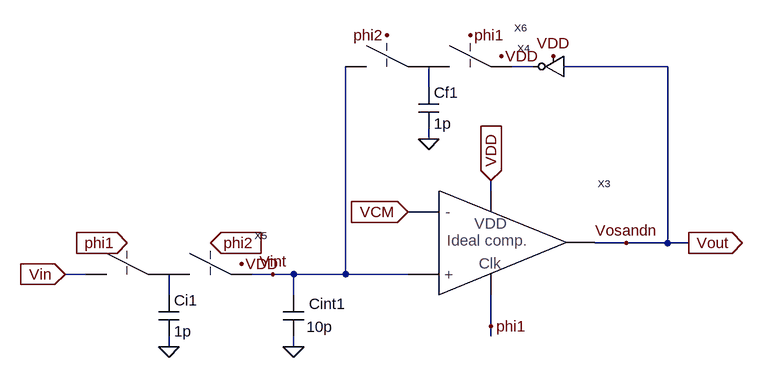
[diagram p0: schematic 1_bit_1st_PNS_SCmod_MSD.asc]
1_bit_1st_PNS_SCmod_MSD.asc, the LTspice schematic file:
Version 4
SHEET 1 1428 680
WIRE 1072 -320 1040 -320
WIRE 1280 -320 1120 -320
WIRE 912 -288 912 -320
WIRE 912 -208 912 -224
WIRE 1008 -128 1008 -144
WIRE 1216 -48 1168 -48
WIRE 1280 -48 1280 -320
WIRE 1280 -48 1216 -48
WIRE 1312 -48 1280 -48
WIRE 384 0 352 0
WIRE 672 0 640 0
WIRE 704 0 672 0
WIRE 784 0 784 -320
WIRE 784 0 704 0
WIRE 880 0 784 0
WIRE 512 32 512 0
WIRE 704 32 704 0
WIRE 1008 80 1008 32
WIRE 1008 96 1008 80
WIRE 512 112 512 96
WIRE 704 112 704 96
FLAG 1312 -48 Vout
IOPIN 1312 -48 Out
FLAG 1008 -144 VDD
IOPIN 1008 -144 In
FLAG 1216 -48 Vosandn
FLAG 704 112 0
FLAG 352 0 Vin
IOPIN 352 0 In
FLAG 672 0 Vint
FLAG 880 -96 VCM
IOPIN 880 -96 In
FLAG 1104 -336 VDD
FLAG 912 -208 0
FLAG 512 112 0
FLAG 1024 -336 VDD
FLAG 624 -16 VDD
FLAG 448 -48 phi1
IOPIN 448 -48 In
FLAG 976 -368 phi1
FLAG 848 -368 phi2
FLAG 576 -48 phi2
IOPIN 576 -48 In
FLAG 1008 80 phi1
SYMBOL Ideal_clocked_comparator 928 -48 R0
SYMATTR InstName X3
SYMBOL cap 688 32 R0
WINDOW 0 40 14 Left 0
WINDOW 3 36 49 Left 0
SYMATTR InstName Cint1
SYMATTR Value 10p
SYMBOL inverter 1120 -320 M0
SYMATTR InstName X4
SYMBOL switches_2 384 16 R0
SYMATTR InstName X5
SYMBOL switches_2 784 -304 R0
SYMATTR InstName X6
SYMBOL cap 496 32 R0
SYMATTR InstName Ci1
SYMATTR Value 1p
SYMBOL cap 896 -288 R0
SYMATTR InstName Cf1
SYMATTR Value 1p

The netlist it stands for:
* 1_bit_1st_PNS_SCmod_MSD.asc
XX3 VCM Vint Vosandn VDD phi1 Ideal_clocked_comparator  ; pins Vinm Vinp Vout VDD Clock
Cint1 Vint 0 10p
XX4 Vosandn N001 VDD inverter  ; pins In Out VDD
XX5 Vin phi1 phi2 Vint VDD N003 switches_2  ; pins P1 clk1 Clk2 P3 VDD P2
XX6 Vint phi2 phi1 N001 VDD N002 switches_2  ; pins P1 clk1 Clk2 P3 VDD P2
Ci1 N003 0 1p
Cf1 N002 0 1p
.backanno
.end